# EAGLE design head (EAGLE 7.4.0)
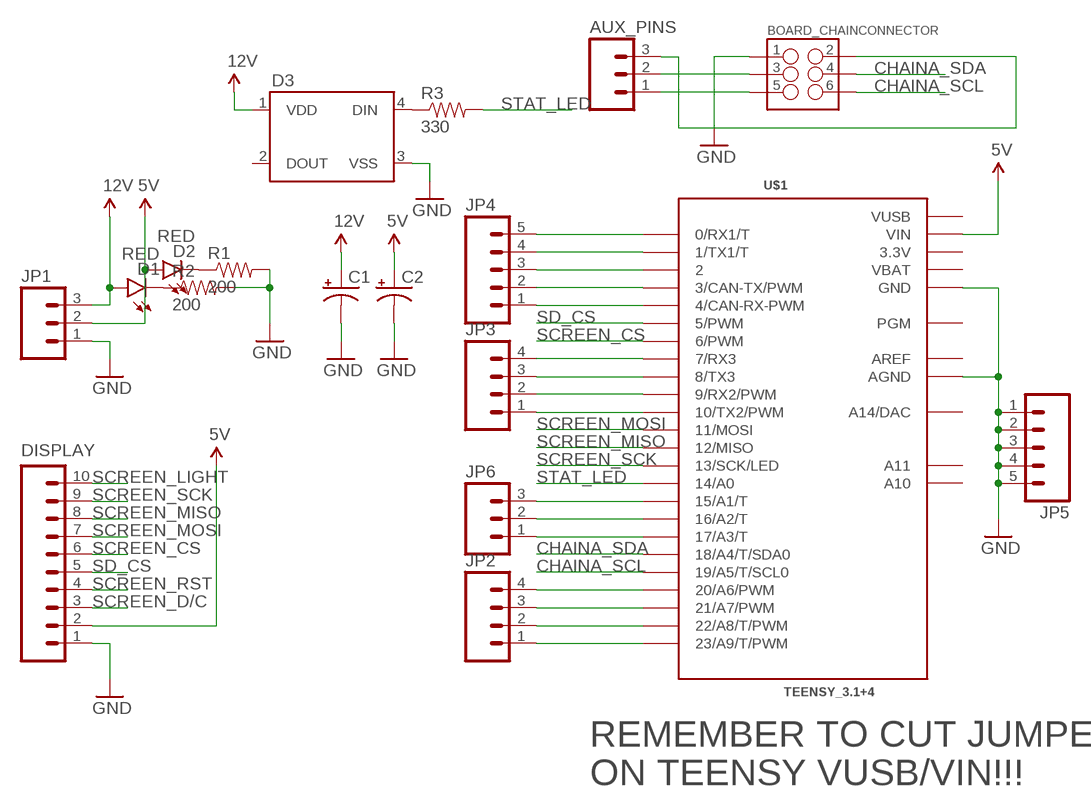
[diagram p0: schematic, sheet 1]

## Parts
AUX_PINS  M03PTH  [1X03]
BOARD_CHAINCONNECTOR  M03X22X3_SILK_MALE_PTH  [2X3]
C1  100UF-25V-20%(PTH)  [CPOL-RADIAL-100UF-25V]
C2  100UF-25V-20%(PTH)  [CPOL-RADIAL-100UF-25V]
D1  RED  LED-RED1206  [LED-1206]
D2  RED  LED-RED1206  [LED-1206]
D3  WS2812B  [WS2812B]
DISPLAY  M10NO_SILK_PTH_FEMALE  [1X10_NO_SILK]
JP1  M03-SCREW-5MM  [SCREWTERMINAL-5MM-3]
JP2  M04PTH  [1X04]
JP3  M04PTH  [1X04]
JP4  M05PTH  [1X05]
JP5  M05PTH  [1X05]
JP6  M03PTH  [1X03]
R1  200  200OHM1/10W1%(0603)  [0603-RES]
R2  200  200OHM1/10W1%(0603)  [0603-RES]
R3  330  RESISTORPTH-1/4W-VERT-KIT  [AXIAL-0.1EZ]
U$1  TEENSY_3.1+4  [TEENSY_3.1+4]

## Nets
5V: C2.1(+) D2.A DISPLAY.2 JP1.2 U$1.VIN
12V: C1.1(+) D1.A D3.1(VDD) JP1.3
CHAINA_SCL: BOARD_CHAINCONNECTOR.6 U$1.19/A5(19/A5/T/SCL0)
CHAINA_SDA: BOARD_CHAINCONNECTOR.4 U$1.18/A4(18/A4/T/SDA0)
GND: BOARD_CHAINCONNECTOR.1 C1.2(-) C2.2(-) D3.3(VSS) DISPLAY.1 JP1.1 JP5.1 JP5.2 JP5.3 JP5.4 JP5.5 R1.2 R2.2 U$1.AGND U$1.GND U$1.GND1(GND)
N$1: AUX_PINS.2 BOARD_CHAINCONNECTOR.3
N$2: AUX_PINS.1 BOARD_CHAINCONNECTOR.5
N$3: AUX_PINS.3 BOARD_CHAINCONNECTOR.2
N$4: D2.C R1.1
N$5: D1.C R2.1
N$6: D3.4(DIN) R3.P$1
N$7: JP6.3 U$1.15/A1(15/A1/T)
N$8: JP2.4 U$1.20/A6(20/A6/PWM)
N$9: JP2.3 U$1.21/A7(21/A7/PWM)
N$10: JP2.2 U$1.22/A8(22/A8/T/PWM)
N$11: JP2.1 U$1.23/A9(23/A9/T/PWM)
N$12: JP3.1 U$1.10(10/TX2/PWM)
N$13: JP3.2 U$1.9(9/RX2/PWM)
N$14: JP3.3 U$1.8(8/TX3)
N$15: JP3.4 U$1.7(7/RX3)
N$16: JP4.1 U$1.4(4/CAN-RX-PWM)
N$17: JP4.2 U$1.3(3/CAN-TX/PWM)
N$18: JP4.3 U$1.2
N$19: JP4.4 U$1.1(1/TX1/T)
N$20: JP4.5 U$1.0(0/RX1/T)
N$21: JP6.2 U$1.16/A2(16/A2/T)
N$22: JP6.1 U$1.17/A3(17/A3/T)
SCREEN_CS: DISPLAY.6 U$1.6(6/PWM)
SCREEN_D/C: DISPLAY.3
SCREEN_LIGHT: DISPLAY.10
SCREEN_MISO: DISPLAY.8 U$1.12(12/MISO)
SCREEN_MOSI: DISPLAY.7 U$1.11(11/MOSI)
SCREEN_RST: DISPLAY.4
SCREEN_SCK: DISPLAY.9 U$1.13(13/SCK/LED)
SD_CS: DISPLAY.5 U$1.5(5/PWM)
STAT_LED: R3.P$2 U$1.14/A0
Unconnected: D3.2(DOUT) U$1.A10 U$1.A11 U$1.A14(A14/DAC) U$1.PGM

## Notes on the sheet
- REMEMBER TO CUT JUMPER
  ON TEENSY VUSB/VIN!!!

## Power pins joined to a net without a drawn wire
3.3V: U$1.3.3V U$1.3.3V1(3.3V)
AREF: U$1.AREF
VBAT: U$1.VBAT
VUSB: U$1.VUSB

## Library data of the parts
AUX_PINS JP6 = SparkFun-Connectors:M03: Header 3 Standard 3-pin 0.1" header. Use with straight break away headers (SKU : PRT-00116), right angle break away headers (PRT-00553), swiss pins (PRT-00743), machine pins (PRT-00117), and female headers (PRT-00115). Molex polarized connector foot print use with SKU : PRT-08232 with associated crimp pins and housings.
BOARD_CHAINCONNECTOR = SparkFun-Connectors:M03X2: 2x3 .1" header. Shrouded, with keying- CONN-10681 SMT- CONN-11415 Pogo pins- HW-11044; PROD_ID: CONN-09701
C1 C2 = SparkFun-Capacitors:100UF-25V-20%(PTH): CAP-08439; PROD_ID: CAP-08439
D1 D2 = SparkFun-LED:LED-RED: Assorted Red LEDs LilyPad 1206- DIO-09912 1206- DIO-00809 0603- DIO-00819 "SMART" means more efficient and expensive; PROD_ID: DIO-09912
D3 = SparkFun-LED:WS2812B: WS2812B - Intelligent control LED integrated light source Technical Specifications: Power Supply Voltage (VDD): 3.5 to 5.3 V Input Voltage (VI): -0.5 to VDD+0.5 V Operating Junction Temperature (Topt): -25°C to +80°C Storage Temperature Range (Tstg): -55°C to +150°C; PROD_ID: DIO-12503
DISPLAY = SparkFun-Connectors:M10: Header 10 Standard 10-pin 0.1" header. Use with straight break away headers (SKU : PRT-00116), right angle break away headers (PRT-00553), swiss pins (PRT-00743), machine pins (PRT-00117), and female headers (PRT-00115).; PROD_ID: CONN-11563
JP1 = SparkFun-Connectors:M03: Header 3 Standard 3-pin 0.1" header. Use with straight break away headers (SKU : PRT-00116), right angle break away headers (PRT-00553), swiss pins (PRT-00743), machine pins (PRT-00117), and female headers (PRT-00115). Molex polarized connector foot print use with SKU : PRT-08232 with associated crimp pins and housings.; STOREFRONT_ID: PRT-08433
JP2 JP3 = SparkFun-Connectors:M04: Header 4 Standard 4-pin 0.1" header. Use with straight break away headers (SKU : PRT-00116), right angle break away headers (PRT-00553), swiss pins (PRT-00743), machine pins (PRT-00117), and female headers (PRT-00115). Molex polarized connector foot print use with SKU : PRT-08231 with associated crimp pins and housings. 1MM SMD Version SKU: PRT-10208
JP4 JP5 = SparkFun-Connectors:M05: Header 5 Standard 5-pin 0.1" header. Use with straight break away headers (SKU : PRT-00116), right angle break away headers (PRT-00553), swiss pins (PRT-00743), machine pins (PRT-00117), and female headers (PRT-00115). Molex polarized connector foot print use with SKU : PRT-08230 with associated crimp pins and housings.
R1 R2 = SparkFun-Resistors:200OHM1/10W1%(0603): RES-08220; PROD_ID: RES-08220
R3 = SparkFun-Resistors:RESISTOR: Resistor Basic schematic elements and footprints for 0603, 1206, and PTH resistors.
U$1 = Teensy_3_Series_Board_v1.0:TEENSY_3.1+4: Footprint for Teensy 3.1 board using all through-holes, i.e. the entire perimeter plus the 4 through-holes inboard (A10,A11,AREF, VUSB)

## Board
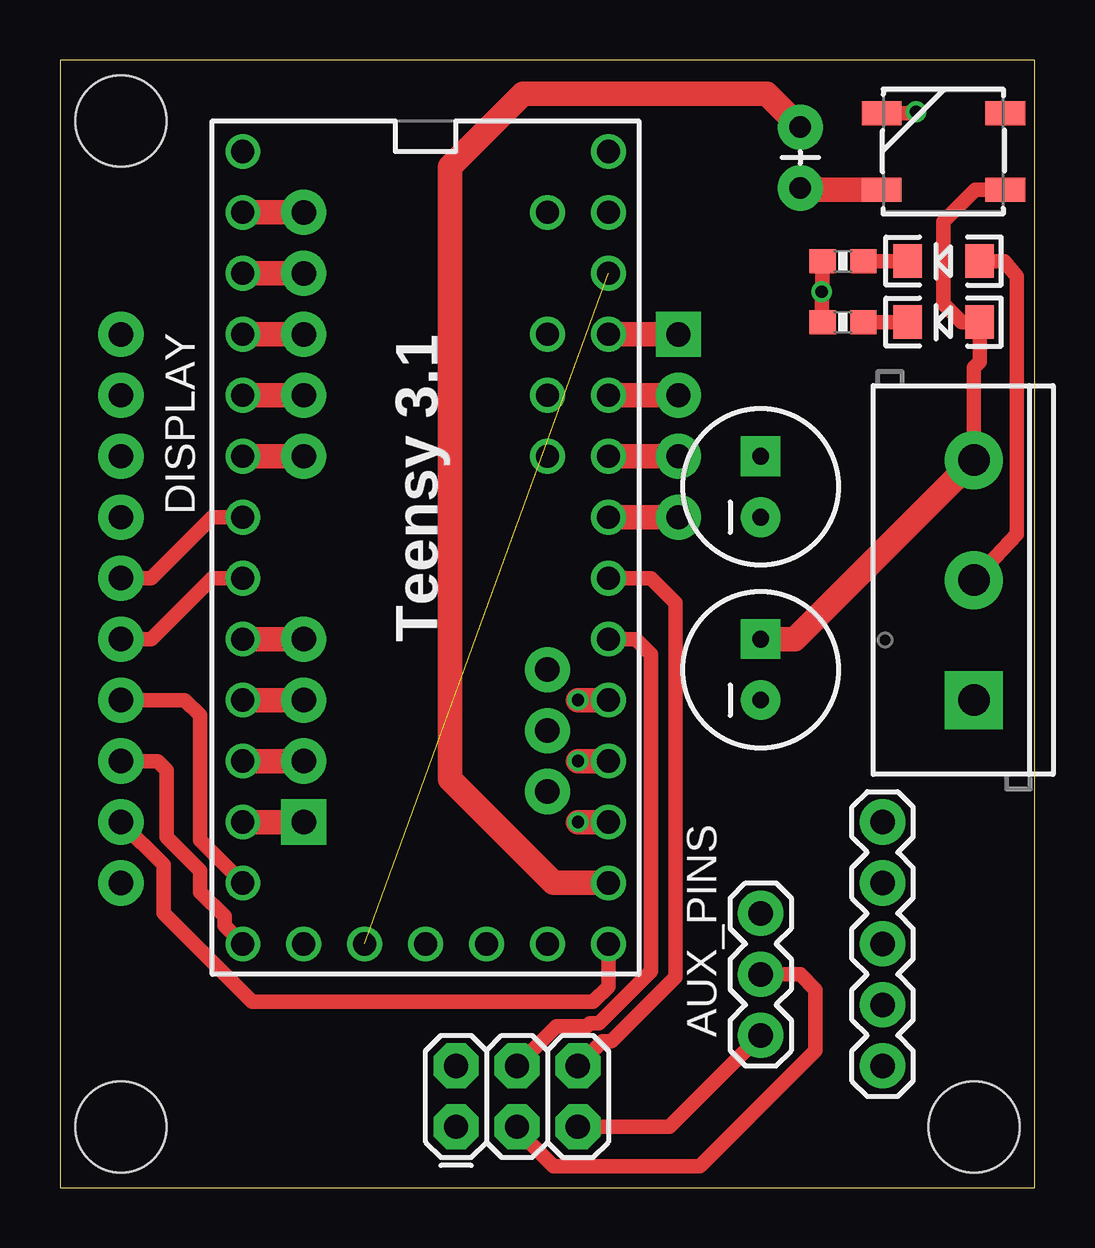
[diagram p1: board, top side]
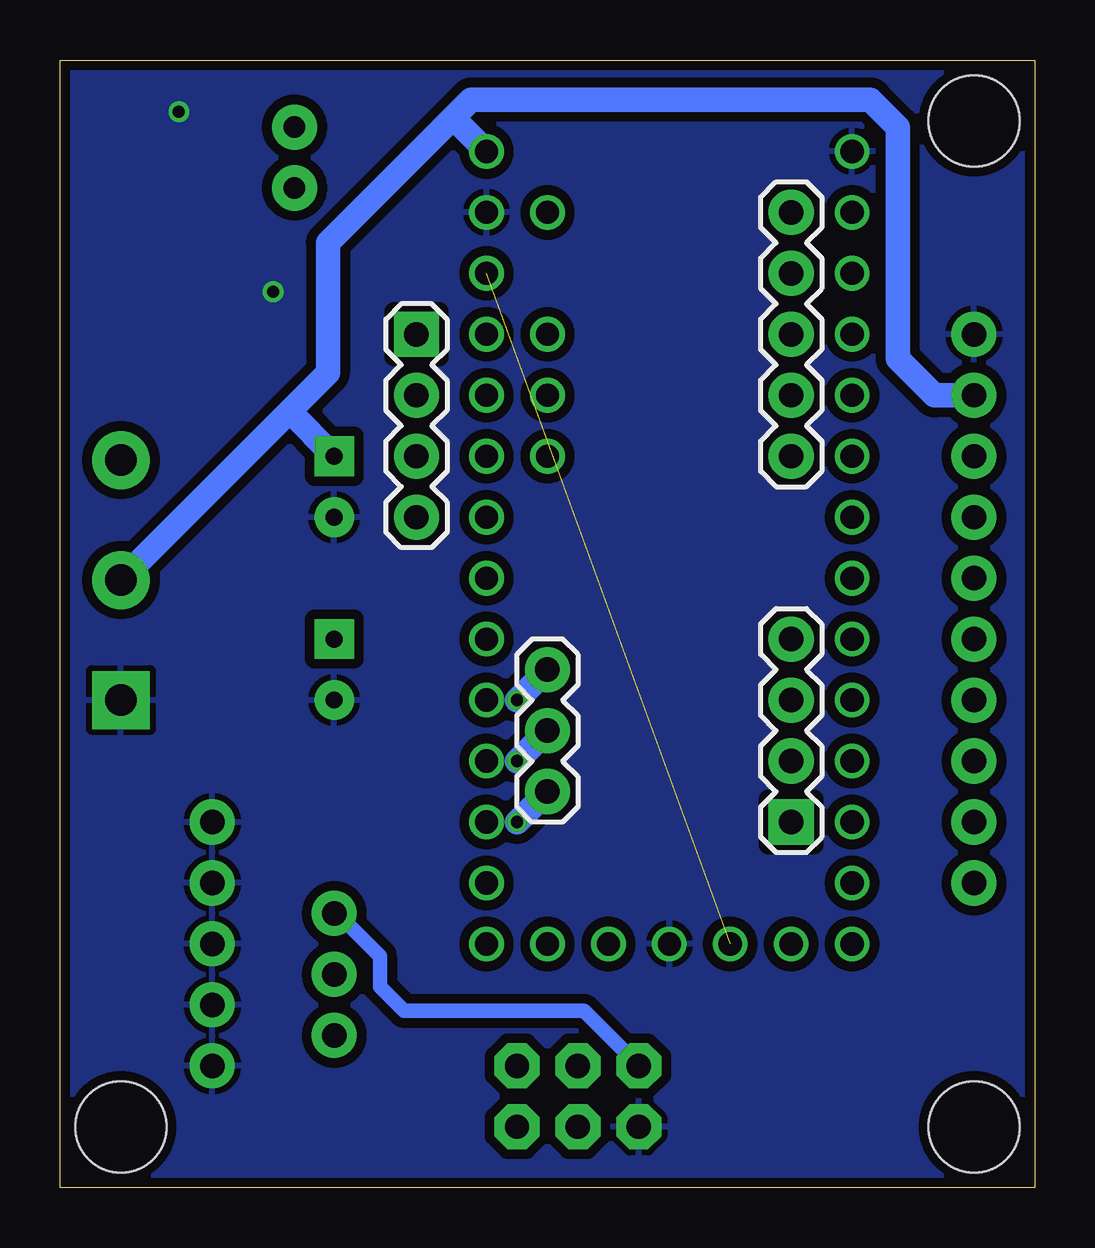
[diagram p2: board, bottom side, seen from below]

Size 40.64 x 46.99 mm. Coordinates in mm from the lower left corner, seen from the top.
Outline: 0,0 40.64,0 40.64,46.99 0,46.99 0,0
Copper layers (1*16): Top 0.0356mm / dielectric 1.5011mm / Bottom 0.0356mm
Design rules "LaenPCBOrder": minimum track width 6mil, minimum drill 13mil, track to track 6mil, track to pad 6mil, pad to pad 6mil, via to via 6mil, smd to smd 6mil, copper to edge 15mil, drill to drill 6mil, minimum pad ring 7mil, minimum via ring 7mil, stop-mask expansion 3mil, vias tented up to drill 0mil, thermal gap 10mil
Holes 3.8 mm at 2.54,2.54 2.54,44.45 38.1,2.54

### Footprints (pad centres in the part's own frame; a part is rotated, then mirrored left to right if it is on the bottom)
1X03 = drill 1.016 pad 1.88: 1 0,0; 2 2.54,0; 3 5.08,0
2X3 = drill 1.016 pad 1.88 octagon: 1 0,0; 2 0,2.54; 3 2.54,0; 4 2.54,2.54; 5 5.08,0; 6 5.08,2.54
CPOL-RADIAL-100UF-25V = drill 0.7 pad 1.651 square: 1 1.27,0 | drill 0.7 pad 1.651: 2 -1.27,0
LED-1206 = smd 1.2 x 1.4: A -1.5,0; C 1.5,0
WS2812B = smd 1.651 x 1: 1 -2.577,1.6; 2 -2.577,-1.6; 3 2.577,-1.6; 4 2.577,1.6
1X10_NO_SILK = drill 1.016 pad 1.88: 1 0,0; 2 2.54,0; 3 5.08,0; 4 7.62,0; 5 10.16,0; 6 12.7,0; 7 15.24,0; 8 17.78,0; 9 20.32,0; 10 22.86,0
SCREWTERMINAL-5MM-3 = drill 1.3 pad 2.413 square: 1 0,0 | drill 1.3 pad 2.413: 2 5,0; 3 10,0
1X04 = drill 1.016 pad 1.88 square: 1 0,0 | drill 1.016 pad 1.88: 2 2.54,0; 3 5.08,0; 4 7.62,0
1X05 = drill 1.016 pad 1.88: 1 0,0; 2 2.54,0; 3 5.08,0; 4 7.62,0; 5 10.16,0
0603-RES = smd 1.1 x 1: 1 -0.85,0; 2 0.85,0
AXIAL-0.1EZ = drill 0.9 pad 1.88: P$1 0,0; P$2 2.54,0
TEENSY_3.1+4 = drill 0.965: 0 -7.62,15.24; 1 -7.62,12.7; 2 -7.62,10.16; 3 -7.62,7.62; 3.3V 7.62,12.7; 3.3V1 -2.54,-15.24; 4 -7.62,5.08; 5 -7.62,2.54; 6 -7.62,0; 7 -7.62,-2.54; 8 -7.62,-5.08; 9 -7.62,-7.62; 10 -7.62,-10.16; 11 -7.62,-12.7; 12 -7.62,-15.24; 13 7.62,-15.24; 14/A0 7.62,-12.7; 15/A1 7.62,-10.16; 16/A2 7.62,-7.62; 17/A3 7.62,-5.08; 18/A4 7.62,-2.54; 19/A5 7.62,0; 20/A6 7.62,2.54; 21/A7 7.62,5.08; 22/A8 7.62,7.62; 23/A9 7.62,10.16; A10 5.08,7.62; A11 5.08,5.08; A14 5.08,-15.24; AGND 7.62,15.24; AREF 5.08,10.16; GND -7.62,17.78; GND1 0,-15.24; PGM 2.54,-15.24; VBAT -5.08,-15.24; VIN 7.62,17.78; VUSB 5.08,15.24

### Placement (x,y rotation side)
AUX_PINS  29.21,6.35 90 top
BOARD_CHAINCONNECTOR  16.51,2.54 0 top
C1  29.21,21.59 90 top
C2  29.21,29.21 90 top
D1  36.83,36.07 180 top
D2  36.83,38.61 180 top
D3  36.83,43.18 180 top
DISPLAY  2.54,35.56 270 top
JP1  38.1,20.32 90 top
JP2  25.78,35.56 270 bottom
JP3  10.16,15.24 90 bottom
JP4  10.16,30.48 90 bottom
JP5  34.29,5.08 90 top
JP6  20.32,21.59 270 bottom
R1  32.64,38.61 180 top
R2  32.64,36.07 180 top
R3  30.86,41.66 90 top
U$1  15.24,25.4 0 top

### Tracks (layer width: path | path; a pad name or v marks a point on that pad's centre or on a via)
3.3V  (1 unrouted)
5V
  Top 0.61: D2.A 39.37,38.61 39.88,37.97 39.88,27.23 JP1.2
  Bottom 1.016: DISPLAY.2 4.19,33.02 5.71,34.54 5.71,44.2 6.86,45.34 23.5,45.34 24.26,44.58 | 24.26,44.58 29.46,39.37 29.46,33.96 31.07,32.34 | 31.07,32.34 JP1.2 | U$1.VIN 24.26,44.58 | C2.1 31.07,32.34
12V
  Top 0.61: JP1.3 38.1,34.16 38.35,34.42 38.35,36.04 D1.A 37.59,36.07 36.83,36.83 36.83,40.26 38.15,41.58 D3.1
  Top 1.016: C1.1 30.64,22.86 JP1.3
CHAINA_SCL
  Top 0.61: U$1.19/A5 24.64,25.4 25.65,24.38 25.65,8.76 22.99,6.1 22.61,6.1 BOARD_CHAINCONNECTOR.6
CHAINA_SDA
  Top 0.61: BOARD_CHAINCONNECTOR.4 20.7,6.73 21.97,6.73 22.1,6.86 22.48,6.86 24.64,9.02 24.64,22.23 24,22.86 U$1.18/A4
GND  (via drill 0.51)
  Top 0.61: R1.2 31.79,37.38 v31.75,37.34 31.75,36.11 R2.2 | D3.3 35.64,44.78 v35.69,44.83
  pour Bottom (isolate 0.406): -1.27,-6.35 44.45,-6.35 44.45,49.53 -1.27,49.53
N$1
  Top 0.61: BOARD_CHAINCONNECTOR.3 19.05,2.41 20.57,0.89 26.67,0.89 31.5,5.71 31.5,8.26 30.86,8.89 AUX_PINS.2
N$2
  Top 0.61: BOARD_CHAINCONNECTOR.5 25.4,2.54 AUX_PINS.1
N$3
  Bottom 0.61: AUX_PINS.3 29.08,11.43 27.3,9.65 27.3,8.38 26.29,7.37 18.8,7.37 BOARD_CHAINCONNECTOR.2
N$4
  Top 0.61: R1.1 D2.C
N$5
  Top 0.61: R2.1 D1.C
N$6
  Top 1.016: R3.P$1 31.52,41.66 31.6,41.58 D3.4 | D3.4
N$7  (via drill 0.51)
  Top 1.016: U$1.15/A1 v21.59,15.24
  Bottom 1.016: v21.59,15.24 JP6.3
N$8
  Top 1.016: U$1.20/A6 JP2.4
N$9
  Top 1.016: U$1.21/A7 JP2.3
N$10
  Top 1.016: U$1.22/A8 JP2.2
N$11
  Top 1.016: JP2.1 U$1.23/A9
N$12
  Top 1.016: U$1.10 JP3.1
N$13
  Top 1.016: U$1.9 JP3.2
N$14
  Top 1.016: U$1.8 JP3.3
N$15
  Top 1.016: U$1.7 JP3.4
N$16
  Top 1.016: U$1.4 JP4.1
N$17
  Top 1.016: U$1.3 JP4.2
N$18
  Top 1.016: U$1.2 JP4.3
N$19
  Top 1.016: U$1.1 JP4.4
N$20
  Top 1.016: U$1.0 JP4.5
N$21  (via drill 0.51)
  Top 1.016: U$1.16/A2 v21.59,17.78
  Bottom 1.016: v21.59,17.78 JP6.2
N$22  (via drill 0.51)
  Top 1.016: U$1.17/A3 v21.59,20.32
  Bottom 1.016: v21.59,20.32 JP6.1
SCREEN_CS
  Top 0.61: DISPLAY.6 3.81,22.86 6.35,25.4 U$1.6
SCREEN_MISO
  Top 0.61: U$1.12 6.86,10.92 6.86,11.3 5.84,12.32 5.84,13.21 4.45,14.61 4.45,17.4 4.06,17.78 DISPLAY.8
SCREEN_MOSI
  Top 0.61: DISPLAY.7 5.21,20.32 5.84,19.68 5.84,14.48 U$1.11
SCREEN_SCK
  Top 0.61: U$1.13 22.86,8.38 22.23,7.75 8,7.75 4.32,11.43 4.32,13.46 DISPLAY.9
SD_CS
  Top 0.61: DISPLAY.5 3.81,25.4 6.35,27.94 U$1.5
STAT_LED
  Top 1.016: U$1.14/A0 20.57,12.7 16.26,17.02 16.26,42.55 19.3,45.59 29.46,45.59 R3.P$2

### Text on the board
tPlace: Teensy 3.1